# Altium schematic sheet -NEW-AQB-5-ANTON_TRANS-PWR-POLYGON.SchDoc
size B; Organization: AQRONOS; Address1: 12789 Emerson St.; Address2: Thornton, CO  80021; Address3: USA
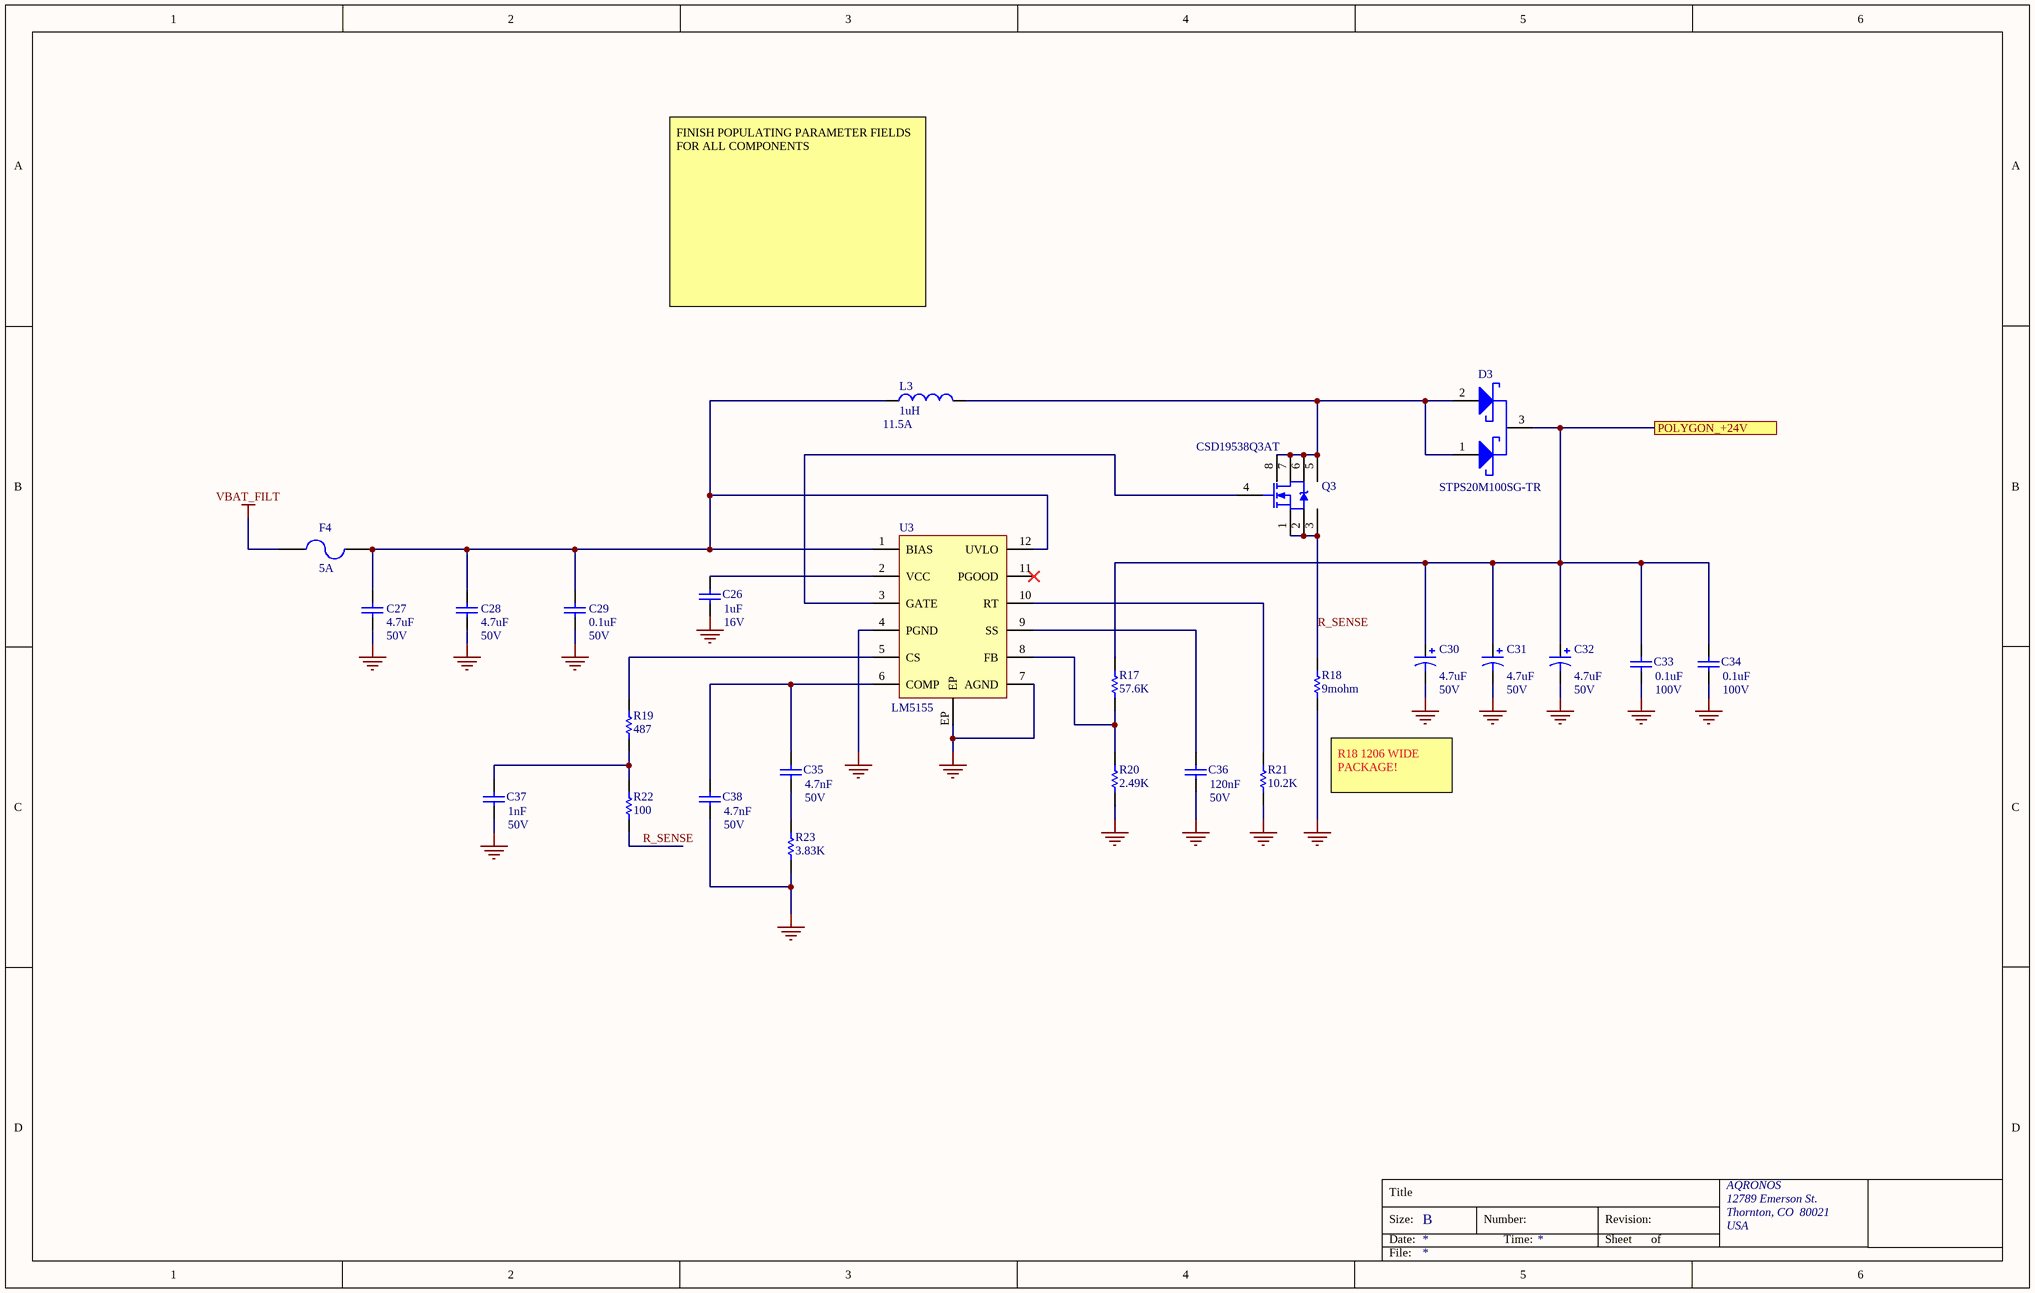
[diagram p0: -NEW-AQB-5-ANTON_TRANS-PWR-POLYGON.SchDoc]

## Parts
C26  value 1uF  Voltage: 16V  [CAP0603]  (hidden comment: Capacitor_non_pol)
C27  value 4.7uF  Voltage: 50V  [CAP0805]  (hidden comment: Capacitor_non_pol)
C28  value 4.7uF  Voltage: 50V  [CAP0805]  (hidden comment: Capacitor_non_pol)
C29  value 0.1uF  Voltage: 50V  [CAP0402]  (hidden comment: Capacitor_non_pol)
C30  value 4.7uF  Voltage: 50V  [CAP1206]  (hidden comment: Capacitor-Polarized)
C31  value 4.7uF  Voltage: 50V  [CAP1206]  (hidden comment: Capacitor-Polarized)
C32  value 4.7uF  Voltage: 50V  [CAP1206]  (hidden comment: Capacitor-Polarized)
C33  value 0.1uF  Voltage: 100V  [CAP0603]  (hidden comment: Capacitor_non_pol)
C34  value 0.1uF  Voltage: 100V  [CAP0603]  (hidden comment: Capacitor_non_pol)
C35  value 4.7nF  Voltage: 50V  [CAP0603]  (hidden comment: Capacitor_non_pol)
C36  value 120nF  Voltage: 50V  [CAP0402]  (hidden comment: Capacitor_non_pol)
C37  value 1nF  Voltage: 50V  [CAP0402]  (hidden comment: Capacitor_non_pol)
C38  value 4.7nF  Voltage: 50V  [CAP0603]  (hidden comment: Capacitor_non_pol)
D3  Manufacturer Part Number: STPS20M100SG-TR  [ONSC-D2PAK-3-418AJ_A_V]  (hidden comment: Schottky-3-Terminal)
F4  Current: 5A  [RES0603]  (hidden comment: Fuse)
L3  1uH  Current: 11.5A  [PA4320.104NLT]
Q3  CSD19538Q3AT  [CSD18531Q5A-3D]
R17  value 57.6K  [RES0402]  (hidden comment: Resistor)
R18  value 9mohm  (hidden comment: Resistor)
R19  value 487  [RES0402]  (hidden comment: Resistor)
R20  value 2.49K  [RES0402]  (hidden comment: Resistor)
R21  value 10.2K  [RES0402]  (hidden comment: Resistor)
R22  value 100  [RES0402]  (hidden comment: Resistor)
R23  value 3.83K  [RES0603]  (hidden comment: Resistor)
U3  LM5155  [LM155 WSON]

## Ports
POLYGON_+24V

## Nets
GND: C26.2 C27.2 C28.2 C29.2 C30.2 C31.2 C32.2 C33.2 C34.2 C36.2 C37.2 C38.2 R18.1 R20.2 R21.2 R23.2 U3.4(PGND) U3.7(AGND) U3.EP
VBAT_FILT: F4.1
POLYGON_+24V: C30.1 C31.1 C32.1 C33.1 C34.1 D3.3(K) R17.1 ; port POLYGON_+24V
R_SENSE: Q3.1(S) Q3.2(S) Q3.3(S) R18.2 R22.2
NetC26_1: C26.1 U3.2(VCC)
NetC27_1: C27.1 C28.1 C29.1 F4.2 L3.1 U3.1(BIAS) U3.12(UVLO)
NetC35_1: C35.1 C38.1 U3.6(COMP)
NetC35_2: C35.2 R23.1
NetC36_1: C36.1 U3.9(SS)
NetC37_1: C37.1 R19.1 R22.1
NetD3_1: D3.1(A) D3.2(A) L3.2 Q3.5(D) Q3.6(D) Q3.7(D) Q3.8(D)
NetQ3_4: Q3.4(G) U3.3(GATE)
NetR17_2: R17.2 R20.1 U3.8(FB)
NetR19_2: R19.2 U3.5(CS)
NetR21_1: R21.1 U3.10(RT)

Not connected (* = marked no-connect by the designer): U3 11(PGOOD)*

## Notes on the sheet
- FINISH POPULATING PARAMETER FIELDS FOR ALL COMPONENTS
- R18 1206 WIDE PACKAGE!
- Title
- Size:
- Date:
- B
- Number:
- Time:
- Revision:
- Sheet
- of
- File:

## Library data of the parts
C26 = Capacitor_non_pol: CAP CER 1UF 16V X7R 0603; Manufacturer Part Number: EMK107B7105KA-T; Distributor Part Number: 587-1241-1-ND; Footprint: *; P/N: *; Tolerance: *; Vendor: *; Manufacturer: *; Power: *; Current: *; Supplier Part Number 1: 587-1241-1-ND
C27 C28 = Capacitor_non_pol: CAP CER 4.7UF 50V X5R 0805; Manufacturer Part Number: C2012X5R1H475K125AB; Distributor Part Number: 445-5980-1-ND; Footprint: *; P/N: *; Tolerance: *; Vendor: *; Manufacturer: *; Power: *; Current: *; Supplier Part Number 1: 445-5980-1-ND
C29 = Capacitor_non_pol: CAP CER 0.1UF 50V X5R 0402; Manufacturer Part Number: C1005X5R1H104K050BB; Distributor Part Number: 445-5942-1-ND; Footprint: *; P/N: *; Tolerance: *; Vendor: *; Manufacturer: *; Power: *; Current: *; Supplier Part Number 1: 445-5942-1-ND
C30-C32 = Capacitor-Polarized: CAP CER 4.7UF 50V X7R 1206; Manufacturer Part Number: C2012X5R1H475K125AB; Distributor Part Number: 490-6521-1-ND; Footprint: *; HelpURL: *; P/N: *; Tolerance: *; Vendor: *; Current: *; Power: *; Manufacturer: *
C33 C34 = Capacitor_non_pol: CAP CER 0.1UF 100V X7R 0603; Manufacturer Part Number: GRM188R72A104KA35D; Distributor Part Number: 490-3285-1-ND; Footprint: *; P/N: *; Tolerance: *; Vendor: *; Manufacturer: *; Power: *; Current: *
C35 C38 = Capacitor_non_pol: CAP CER 4700PF 50V C0G 0603; Manufacturer Part Number: CGA3E2C0G1H472J080AA; Distributor Part Number: 445-6912-1-ND; Footprint: *; P/N: *; Tolerance: *; Vendor: *; Manufacturer: *; Power: *; Current: *; Supplier Part Number 1: 445-6912-1-ND
C36 = Capacitor_non_pol: Manufacturer Part Number: C1812C124J5GACTU; Distributor Part Number: 490-1311-1-ND; Footprint: *; P/N: *; Tolerance: *; Vendor: *; Manufacturer: *; Power: *; Current: *; Supplier Part Number 1: 490-1311-1-ND
C37 = Capacitor_non_pol: CAP CER 1000PF 50V C0G/NP0 0402; Manufacturer Part Number: GRM1555C1H102JA01J; Distributor Part Number: 490-6190-1-ND; Footprint: *; P/N: *; Tolerance: *; Vendor: *; Manufacturer: *; Power: *; Current: *
D3 = Schottky-3-Terminal: DIODE SCHOTTKY 100V 20A D2PAK; Manufacturer: On Semiconductor; Direction: Unidirectional; IR Max (uA): 5; Packing: Tape and Reel; PPK Max (W): 600; V(BR) Typ (V): 20; DatasheetVersion: Rev. J; PackageVersion: Rev. J, 07/2012; PackageReference: SMB-2-403A-03_J; PackageDescription: 2-Pin Small Molded Package, J-Bend Lead, Body 4.33 x 3.625 mm; Supplier 1: Digi-Key; Supplier Part Number 1: 497-10993-1-ND; Supplier 2: Mouser; Supplier Part Number 2: 497-10993-1-ND; RoHS: Pb-Free; Mounting Technology: Surface Mount; PartNumber: STPS20M100SG-TR; ComponentLink1Description: Manufacturer URL; ComponentLink1URL: http://www.onsemi.com/; ComponentLink2Description: Datasheet; ComponentLink2URL: http://www.onsemi.com/pub_link/Collateral/P6SMB6.8AT3-D.PDF; ComponentLink3Description: Package Specification; ComponentLink3URL: http://www.onsemi.com/pub_link/Collateral/P6SMB6.8AT3-D.PDF; Distributor Part Number: 497-10993-1-ND
F4 = Fuse: FUSE BOARD MNT 5A 32VAC/VDC 0603; Manufacturer Part NUmber: TR/0603FA5-R; Manufacturer: Eaton; Published: 8-Jun-2000; LatestRevisionDate: 17-Jul-2002; LatestRevisionNote: Re-released for DXP Platform.; PackageReference: PIN-W2/E2.8; Publisher: Altium Limited; Vendor: *; Distributor Part Number: 283-2564-1-ND; Voltage: *; Power: *; Tolerance: *; Footprint: 0603
L3 = Inductor: Fixed Inductors 4.7uH 20% 11A 14.40mOhms AEC-Q200; Manufacturer Part Number: 744316100; Distributor Part Number: 732-6176-1-ND; Footprint: *; HelpURL: *; Manufacturer: *; Tolerance: *; Value: *; Voltage: *; Power: *
Q3 = CSD18531Q5A: Manufacturer Part Number: CSD18543Q3A; Published: 8-Jun-2000; LatestRevisionDate: 17-Jul-2002; LatestRevisionNote: Re-released for DXP Platform.; DatasheetVersion: 6-Oct-1997; PackageVersion: Aug-1998; PackageReference: VSONP; Publisher: Altium Limited; PackageDescription: SOT-457/SC-74; 6 Leads; Body 3.1 x 3 mm, inc. leads (LxW max); ComponentLink1Description: Manufacturer Link; ComponentLink1URL: http://www.vishay.com/; ComponentLink2Description: Datasheet; ComponentLink2URL: http://www.vishay.com/docs/70192/70192.pdf; Distributor Part Number: 296-45302-1-ND
R17 = Resistor: Manufacturer Part Number: RG1608P-5762-B-T5; Distributor Part Number: RG16P57.6KBCT-ND; Footprint: *; HelpURL: *; P/N: *; Tolerance: *; Vendor: *; Voltage: *; Power: *; Current: *; Manufacturer: *
R18 = Resistor: RES 0.009 OHM 1W 1206 WIDE; Manufacturer Part Number: PRL1632-R009-F-T1; Distributor Part Number: PRL1632.009FCT-ND; Footprint: *; HelpURL: *; P/N: *; Tolerance: *; Vendor: *; Voltage: *; Power: *; Current: *; Manufacturer: *
R19 = Resistor: RES SMD 487 OHM 1% 1/5W 0402; Manufacturer Part Number: CRCW0402487RFKED; Distributor Part Number: 541-487YCT-ND; Footprint: *; HelpURL: *; P/N: *; Tolerance: *; Vendor: *; Voltage: *; Power: *; Current: *; Manufacturer: *
R20 = Resistor: Manufacturer Part Number: RG1608P-2491-B-T5; Distributor Part Number: RG16P2.49KBCT-ND; Footprint: *; HelpURL: *; P/N: *; Tolerance: *; Vendor: *; Voltage: *; Power: *; Current: *; Manufacturer: *
R21 = Resistor: RES SMD 10.2KOHM 0.1% 1/16W 0402; Manufacturer Part Number: ERA-2AEB1022X; Distributor Part Number: P10.2KDCCT-ND; Footprint: *; HelpURL: *; P/N: *; Tolerance: *; Vendor: *; Voltage: *; Power: *; Current: *; Manufacturer: *
R22 = Resistor: RES SMD 100 OHM 1% 1/16W 0402; Manufacturer Part Number: CRCW0402100RFKED; Distributor Part Number: 541-100LCT-ND; Footprint: *; HelpURL: *; P/N: *; Tolerance: *; Vendor: *; Voltage: *; Power: *; Current: *; Manufacturer: *
R23 = Resistor: RES SMD 3.83KOHM 0.1% 1/10W 0603; Manufacturer Part Number: RT0603BRD073K83L; Distributor Part Number: YAG4549CT-ND; Footprint: *; HelpURL: *; P/N: *; Tolerance: *; Vendor: *; Voltage: *; Power: *; Current: *; Manufacturer: *; Supplier Part Number 1: P36.5KDCCT-ND
U3 = LM5155: 60V Low Side Controller for Boost and SEPIC, 10-pin MSOP, Pb-Free; Manufacturer Part Number: LM51551DSST; PowerWise: Y; CompType: Switcher; DatasheetVersion: Oct-2009; PackageVersion: revB, Jul-2003; PackageReference: MUB10A; PackageDescription: Mini-SO, Molded, .118 x .118 x .034in Body, 10 Lead, .0197in Pitch; RoHS: Y; PinCount: 10; High-Reliability: Y; Code_JEDEC: MO-187-BA; ComponentLink1Description: Manufacturer URL; ComponentLink1URL: http://www.national.com/; ComponentLink2Description: LM5022 Datasheet; ComponentLink2URL: http://www.national.com/ds/LM/LM5022.pdf; ComponentLink3Description: LM5022 Web Page; ComponentLink3URL: http://www.national.com/pf/LM/LM5022.html; ComponentLink4Description: MUB10A Package Page; ComponentLink4URL: http://www.national.com/packaging/folders/mub10a.html; Distributor Part Number: 296-53427-1-ND